# Altium project LCDTestor_EP4CE6E22.PRJPCB
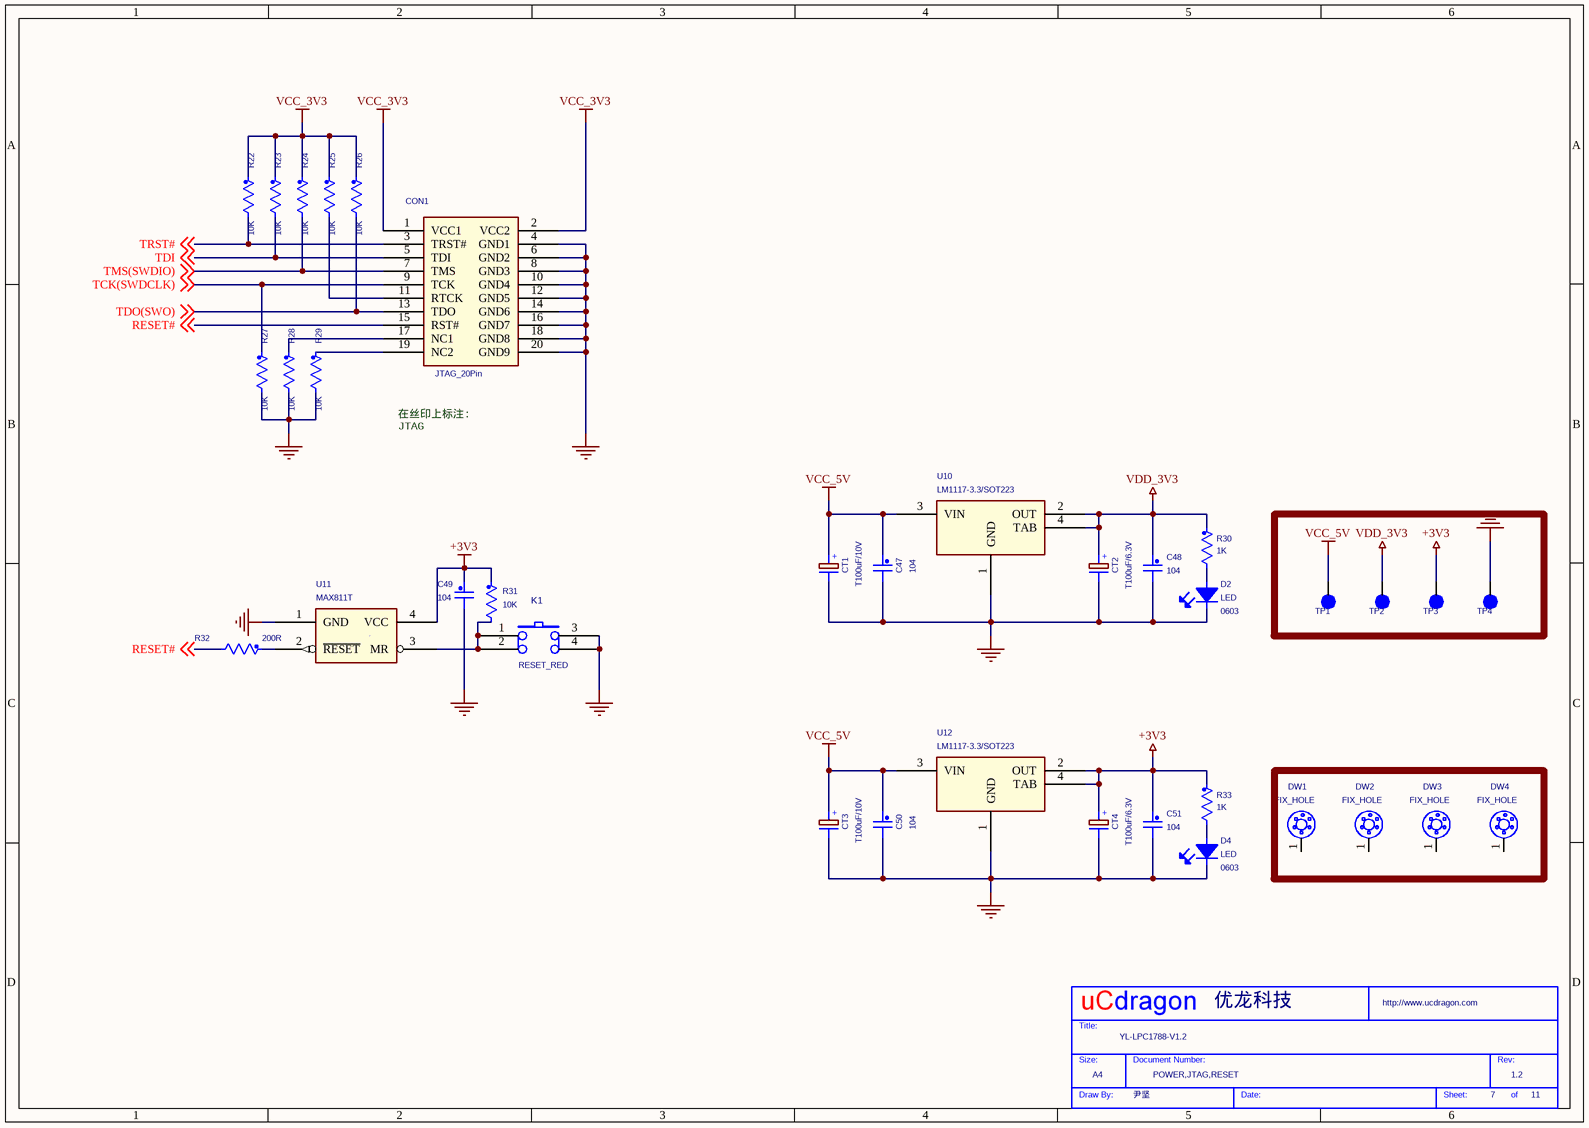
[diagram p0: 07)Power,JTAG,RESET.SchDoc]
9 sheets, 228 parts. Net scope: global (net labels, ports and power ports of the same name join across sheets).
Sheets:
  07)Power,JTAG,RESET.SchDoc
  06)LCD.SchDoc
  05)NorFlash,NandFlash.SchDoc
  04)SDRAM.SchDoc
  03)CPU-3.SchDoc
  02)CPU-2.SchDoc
  01)CPU-1.SchDoc
  08)USB HOST,USB Device,.SchDoc
  09)KEY,LED.SchDoc

## Sheet 07)Power,JTAG,RESET.SchDoc
size 297 x 209 mm

### Parts
(Parts that share a designator on the sheet are numbered #1, #2 ... from top to bottom, then left to right.)
*#1  Page Count: 11  Page Number: 7  Page Size: A4  Title: YL-LPC1788-V1.2  RevCode: 1.2  Doc: POWER,JTAG,RESET  Drawing: 尹坚  Company: 优龙科技  (hidden comment: My Title 0)  (graphical)
C47  104  [CAP0805]
C48  104  [CAP0805]
C49  104  [CAP0805]
C50  104  [CAP0805]
C51#1  104  [CAP0805]
CON1  JTAG_20Pin
CT1  T100uF/10V  [TAN-C]
CT2  T100uF/6.3V  [TAN-B]
CT3  T100uF/10V  [TAN-C]
CT4  T100uF/6.3V  [TAN-B]
D2#1  LED  Note: 0603  [LED3]
D4#1  LED  Note: 0603  [LED3]
DW1  FIX_HOLE  [FULCRUM2]
DW2  FIX_HOLE  [FULCRUM2]
DW3  FIX_HOLE  [FULCRUM2]
DW4  FIX_HOLE  [FULCRUM2]
K1#1  RESET_RED  [SWPB2]
R22  10K  [RES0805]
R23#1  10K  [RES0805]
R24#1  10K  [RES0805]
R25#1  10K  [RES0805]
R26#1  10K  [RES0805]
R27#1  10K  [RES0805]
R28#1  10K  [RES0805]
R29#1  10K  [RES0805]
R30#1  1K  [RES0805]
R31#1  10K  [RES0805]
R32#1  200R  [RES0805]
R33#1  1K  [RES0805]
TP1  TP-SMD  (value not drawn)
TP2  TP-SMD  (value not drawn)
TP3  TP-SMD  (value not drawn)
TP4  TP-SMD  (value not drawn)
U10  LM1117-3.3/SOT223  [XP-SOT223-3]
U11  MAX811T  [SOT143A]
U12  LM1117-3.3/SOT223  [XP-SOT223-3]

### Nets
+3V3: C49.1 C51#1.1 CT4.1 R31#1.1 R33#1.1 TP3.1 U11.4(VCC) U12.2(OUT) U12.4(TAB)
GND_POWER: C47.2 C48.2 C49.2 C50.2 C51#1.2 CON1.4(GND1) CON1.6(GND2) CON1.8(GND3) CON1.10(GND4) CON1.12(GND5) CON1.14(GND6) CON1.16(GND7) CON1.18(GND8) CON1.20(GND9) CT1.2 CT2.2 CT3.2 CT4.2 D2#1.2(K) D4#1.2(K) K1#1.3 K1#1.4 R27#1.2 R28#1.2 R29#1.2 TP4.1 U10.1(GND) U11.1(GND) U12.1(GND)
VCC_3V3: CON1.1(VCC1) CON1.2(VCC2) R22.1 R23#1.1 R24#1.1 R25#1.1 R26#1.1
VCC_5V: C47.1 C50.1 CT1.1 CT3.1 TP1.1 U10.3(VIN) U12.3(VIN)
VDD_3V3: C48.1 CT2.1 R30#1.1 TP2.1 U10.2(OUT) U10.4(TAB)
RESET#: CON1.15(RST#) R32#1.2 ; off-sheet RESET#
TCK(SWDCLK): CON1.9(TCK) R27#1.1 ; off-sheet TCK(SWDCLK)
TDI: CON1.5(TDI) R23#1.2 ; off-sheet TDI
TDO(SWO): CON1.13(TDO) R26#1.2 ; off-sheet TDO(SWO)
TMS(SWDIO): CON1.7(TMS) R24#1.2 ; off-sheet TMS(SWDIO)
TRST#: CON1.3(TRST#) R22.2 ; off-sheet TRST#
NetCON1_11: CON1.11(RTCK) R25#1.2
NetCON1_17: CON1.17(NC1) R28#1.1
NetCON1_19: CON1.19(NC2) R29#1.1
NetD2#1_1: D2#1.1(A) R30#1.2
NetD4#1_1: D4#1.1(A) R33#1.2
NetK1#1_1: K1#1.1 K1#1.2 R31#1.2 U11.3(MR)
NetR32#1_1: R32#1.1 U11.2(~{RESET})

Not connected (* = marked no-connect by the designer): DW1 1; DW2 1; DW3 1; DW4 1

### Notes on the sheet
- 在丝印上标注:
  JTAG
- (in symbol My Title 0) Title:; Size:; Document Number:; Rev:; Draw By:; Date:; Sheet:; of

### Library data of the parts
C47-C50 C51#1 = C_Generic_Dup1: Dielectric: X7R; Mfg #1: KEMET; Voltage: 16V; P/N #1: C0603C104K4RAC; Toler.: 10%
CT1-CT4 = CAP PN_Dup1: SDTSourceLibName: C:\WINDOWS\TEMP\SNDS.LIB
D2#1 D4#1 = LED-Small
K1#1 = SW_PUSH2: SDTSourceLibName: C:\WIND95\TEMP\6200.LIB
R22 R23#1 R24#1 R25#1 R26#1 R27#1 R28#1 R29#1 R31#1 R32#1 = R_Generic_Dup1: Toler.: 1%; Watts: 0.1W; P/N #1: CR10-1001F-T; Mfg #1: AVX
R30#1 R33#1 = R_Generic_Dup1: P/N #3: CR10-103J-T; Toler.: 1%; Watts: 0.1W; P/N #1: RK73H1JT1002F; Mfg #1: KOA SPEER; Mfg #3: AVX
TP1-TP4 = TP-SMD_1
U10 U12 = LM1117 SOT223
U11 = UD215_1
*#1 = My Title 0: Page Create Date: May 29, 2006; WebSite: http://www.ucdragon.com

## Sheet 06)LCD.SchDoc
size 292 x 193 mm
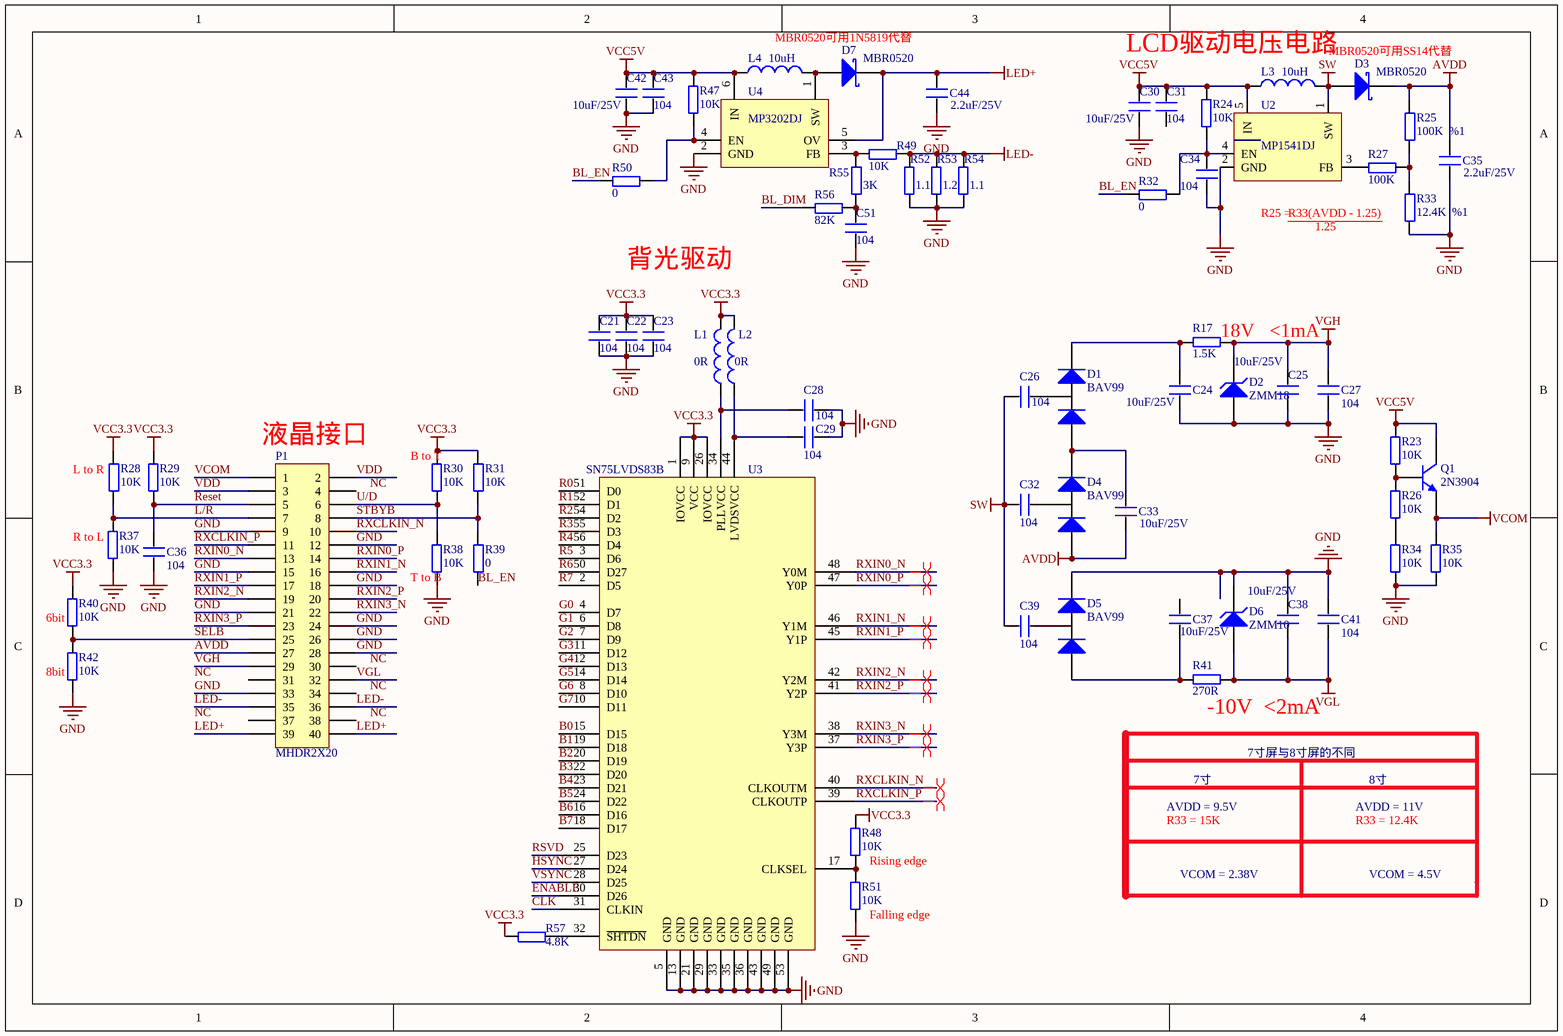
[diagram p1: 06)LCD.SchDoc]

### Parts
(Parts that share a designator on the sheet are numbered #1, #2 ... from top to bottom, then left to right.)
C21#1  104  [0603P]
C22#1  104  [0603P]
C23#1  104  [0603P]
C24#1  10uF/25V  [1206]
C25#1  10uF/25V  [1206]
C26#1  104  [0603P]
C27#1  104  [0603P]
C28#1  104  [0603P]
C29  104  [0603P]
C30  10uF/25V  [1206]
C31  104  [0603P]
C32  104  [0603P]
C33  10uF/25V  [1206]
C34  104  [0603P]
C35  2.2uF/25V  [1206]
C36  104  [0603P]
C37  10uF/25V  [1206]
C38  10uF/25V  [1206]
C39  104  [0603P]
C41  104  [0603P]
C42  10uF/25V  [1206]
C43  104  [0603P]
C44  2.2uF/25V  [1206]
C51#2  104  [0603P]
D1  BAV99  [SOT-23-3L]
D2#2  ZMM18  [LL-34]
D3  MBR0520  [DSO-C2/X2.3]
D4#2  BAV99  [SOT-23-3L]
D5  BAV99  [SOT-23-3L]
D6  ZMM10  [LL-34]
D7  MBR0520  [DSO-C2/X2.3]
L1  value 0R  [0603P]  (hidden comment: Inductor)
L2  value 0R  [0603P]  (hidden comment: Inductor)
L3  value 10uH  [1206]  (hidden comment: Inductor)
L4  value 10uH  [1206]  (hidden comment: Inductor)
P1#1  MHDR2X20  [FH12A-40S-0.5SH]
Q1  2N3904  [SOT-23-3L]
R17  1.5K  [0603P]
R23#2  10K  [0603P]
R24#2  10K  [0603P]
R25#2  100K  %1  [0603P]
R26#2  10K  [0603P]
R27#2  100K  [0603P]
R28#2  10K  [0603P]
R29#2  10K  [0603P]
R30#2  10K  [0603P]
R31#2  10K  [0603P]
R32#2  0  [0603P]
R33#2  12.4K  %1  [0603P]
R34  10K  [0603P]
R35  10K  [0603P]
R37  10K  [0603P]
R38  10K  [0603P]
R39  0  [0603P]
R40  10K  [0603P]
R41  270R  [0603P]
R42  10K  [0603P]
R47  10K  [0603P]
R48  10K  [0603P]
R49  10K  [0603P]
R50  0  [0603P]
R51  10K  [0603P]
R52  1.1  [0603P]
R53  1.2  [0603P]
R54  1.1  [0603P]
R55  3K  [0603P]
R56  82K  [0603P]
R57  4.8K  [0603P]
U2#1  MP1541DJ  [SOT-23-5L]
U3#1  SN75LVDS83B  [DGG056]
U4#1  MP3202DJ  [SOT-23-6L]

### Nets
AVDD: C33.2 C35.1 D3.2(K) D4#2.1(A) P1#1.27 R25#2.2
GND: C21#1.1 C22#1.1 C23#1.1 C24#1.2 C25#1.2 C27#1.2 C28#1.1 C29.1 C30.2 C34.1 C35.2 C36.1 C38.1 C41.1 C42.2 C43.1 C44.2 C51#2.1 D2#2.1(A) D5.2(K) D6.2(K) P1#1.9 P1#1.12 P1#1.15 P1#1.18 P1#1.21 P1#1.24 P1#1.26 P1#1.28 P1#1.33 R33#2.1 R34.2 R35.2 R37.2 R38.2 R42.2 R51.2 R52.2 R53.2 R54.2 U2#1.2(GND) U3#1.5(GND) U3#1.13(GND) U3#1.21(GND) U3#1.29(GND) U3#1.33(GND) U3#1.35(GND) U3#1.36(GND) U3#1.43(GND) U3#1.49(GND) U3#1.53(GND) U4#1.2(GND)
LED+: C44.1 D7.2(K) P1#1.39 P1#1.40 U4#1.5(OV)
LED-: P1#1.35 P1#1.36 R49.2 R52.1 R53.1 R54.1
SW: C26#1.2 C32.1 C39.1 D3.1(A) L3.2 U2#1.1(SW)
VCC3.3: C21#1.2 C22#1.2 C23#1.2 L1.2 L2.2 R28#2.2 R29#2.1 R30#2.1 R31#2.2 R40.1 R48.1 R57.1 U3#1.1(IOVCC) U3#1.9(VCC) U3#1.26(IOVCC)
VCC5V: C30.1 C31.2 C42.1 C43.2 L3.1 L4.1 Q1.3(C) R23#2.1 R24#2.1 R47.1 U2#1.5(IN) U4#1.6(IN)
VCOM: P1#1.1 Q1.2(E) R35.1
VGH: C25#1.1 C27#1.1 D2#2.2(K) P1#1.29 R17.1
VGL: C38.2 C41.2 D6.1(A) P1#1.32 R41.1
B0: U3#1.15(D15)
B1: U3#1.19(D18)
B2: U3#1.20(D19)
B3: U3#1.22(D20)
B4: U3#1.23(D21)
B5: U3#1.24(D22)
B6: U3#1.16(D16)
B7: U3#1.18(D17)
BL_DIM: R56.1
BL_EN: R32#2.1 R39.1 R50.1
CLK: U3#1.31(CLKIN)
ENABLE: U3#1.30(D26)
G0: U3#1.4(D7)
G1: U3#1.6(D8)
G2: U3#1.7(D9)
G3: U3#1.11(D12)
G4: U3#1.12(D13)
G5: U3#1.14(D14)
G6: U3#1.8(D10)
G7: U3#1.10(D11)
HSYNC: U3#1.27(D24)
L/R: P1#1.7 R28#2.1 R37.1
R0: U3#1.51(D0)
R1: U3#1.52(D1)
R2: U3#1.54(D2)
R3: U3#1.55(D3)
R4: U3#1.56(D4)
R5: U3#1.3(D6)
R6: U3#1.50(D27)
R7: U3#1.2(D5)
Reset: C36.2 P1#1.5 R29#2.2
RSVD: U3#1.25(D23)
RXCLKIN_N: P1#1.10 U3#1.40(CLKOUTM)
RXCLKIN_P: P1#1.11 U3#1.39(CLKOUTP)
RXIN0_N: P1#1.13 U3#1.48(Y0M)
RXIN0_P: P1#1.14 U3#1.47(Y0P)
RXIN1_N: P1#1.16 U3#1.46(Y1M)
RXIN1_P: P1#1.17 U3#1.45(Y1P)
RXIN2_N: P1#1.19 U3#1.42(Y2M)
RXIN2_P: P1#1.20 U3#1.41(Y2P)
RXIN3_N: P1#1.22 U3#1.38(Y3M)
RXIN3_P: P1#1.23 U3#1.37(Y3P)
SELB: P1#1.25 R40.2 R42.1
STBYB: P1#1.8 R31#2.1 R39.2
U/D: P1#1.6 R30#2.2 R38.1
VDD: P1#1.2 P1#1.3
VSYNC: U3#1.28(D25)
NetC24#1_1: C24#1.1 D1.2(K) R17.2
NetC26#1_1: C26#1.1 D1.3(A)
NetC28#1_2: C28#1.2 L1.1 U3#1.34(PLLVCC)
NetC29_2: C29.2 L2.1 U3#1.44(LVDSVCC)
NetC32_2: C32.2 D4#2.3(A)
NetC33_1: C33.1 D1.1(A) D4#2.2(K)
NetC34_2: C34.2 R24#2.2 R32#2.2 U2#1.4(EN)
NetC37_2: C37.2 D5.1(A) R41.2
NetC39_2: C39.2 D5.3(A)
NetC51#2_2: C51#2.2 R55.1 R56.2
NetD7_1: D7.1(A) L4.2 U4#1.1(SW)
NetQ1_1: Q1.1(B) R23#2.2 R26#2.1
NetR25#2_1: R25#2.1 R27#2.2 R33#2.2
NetR26#2_2: R26#2.2 R34.1
NetR27#2_1: R27#2.1 U2#1.3(FB)
NetR47_2: R47.2 R50.2 U4#1.4(EN)
NetR48_2: R48.2 R51.1 U3#1.17(CLKSEL)
NetR49_1: R49.1 R55.2 U4#1.3(FB)
NetR57_2: R57.2 U3#1.32(~{SHTDN})

Not connected (* = marked no-connect by the designer): C31 1; C37 1; P1#1 4 30 31 34 37 38

### Layout directives
differential pair: RXCLKIN_N, RXCLKIN_P, RXIN0_N, RXIN0_P, RXIN1_N, RXIN1_P, RXIN2_N, RXIN2_P, RXIN3_N, RXIN3_P

### Notes on the sheet
- MBR0520可用1N5819代替
- LCD驱动电压电路
- MBR0520可用SS14代替
- R25 =
- R33(AVDD - 1.25)
- 1.25
- 背光驱动
- (near R17) 18V   <1mA
- (near P1#1) 液晶接口
- (near R28#2) L to R
- (near R30#2) B to T
- (near R37) R to L
- (near R38) T to B
- (near R40) 6bit
- (near R42) 8bit
- (near R41) -10V  <2mA
- 7寸
- 7寸屏与8寸屏的不同
- 8寸
- AVDD = 9.5V
- R33 = 15K
- AVDD = 11V
- R33 = 12.4K
- Rising edge
- (near R51) Falling edge
- VCOM = 2.38V
- VCOM = 4.5V
- Labels drawn without touching a wire or pin: NC

### Library data of the parts
C21#1 C22#1 C23#1 C24#1 C25#1 C26#1 C27#1 C28#1 C29-C39 C41-C44 C51#2 = C
D2#2 D6 = D Zener: Zener Diode; Published: 8-Jun-2000; LatestRevisionDate: 17-Jul-2002; LatestRevisionNote: Re-released for DXP Platform.; PackageReference: DIODE-0.7; Publisher: Altium Limited
D3 D7 = D Schottky: Schottky Diode; Published: 8-Jun-2000; LatestRevisionDate: 17-Jul-2002; LatestRevisionNote: Re-released for DXP Platform.; PackageReference: SMB; Publisher: Altium Limited; Code_JEDEC: DO-214-AA
L1-L4 = Inductor: Code_IEC: 1005; Published: 8-Jun-2000; LatestRevisionDate: 29-May-2009; LatestRevisionNote: IPC-7351 Footprint Added.; PackageReference: 0402-A; Publisher: Altium Limited; PackageDescription: Chip Inductor; Code_JEITA: 0402
P1#1 = MHDR2X20: Header, 20-Pin, Dual row; LatestRevisionDate: 17-Jul-2002; LatestRevisionNote: Re-released for DXP Platform.; Publisher: Altium Limited
Q1 = 2N3904: NPN General Purpose Amplifier; Published: 8-Jun-2000; LatestRevisionDate: 15-Jan-2003; LatestRevisionNote: PCB Footprint 'BCY-W3/D4.7' replaced; DatasheetVersion: 1997; PackageVersion: Sep-1998; PackageReference: TO-92A; Publisher: Altium Limited; Code_JEDEC: TO-92A; ComponentLink1Description: Manufacturer Link; ComponentLink1URL: http://www.fairchildsemi.com/; ComponentLink2Description: Datasheet; ComponentLink2URL: http://www.fairchildsemi.com/ds/2N%2F2N3904.pdf
R17 R23#2 R24#2 R25#2 R26#2 R27#2 R28#2 R29#2 R30#2 R31#2 R32#2 R33#2 R34 R35 R37-R42 R47-R57 = R
U2#1 = MP1541
U4#1 = MP3202

## Sheet 05)NorFlash,NandFlash.SchDoc
size 297 x 209 mm
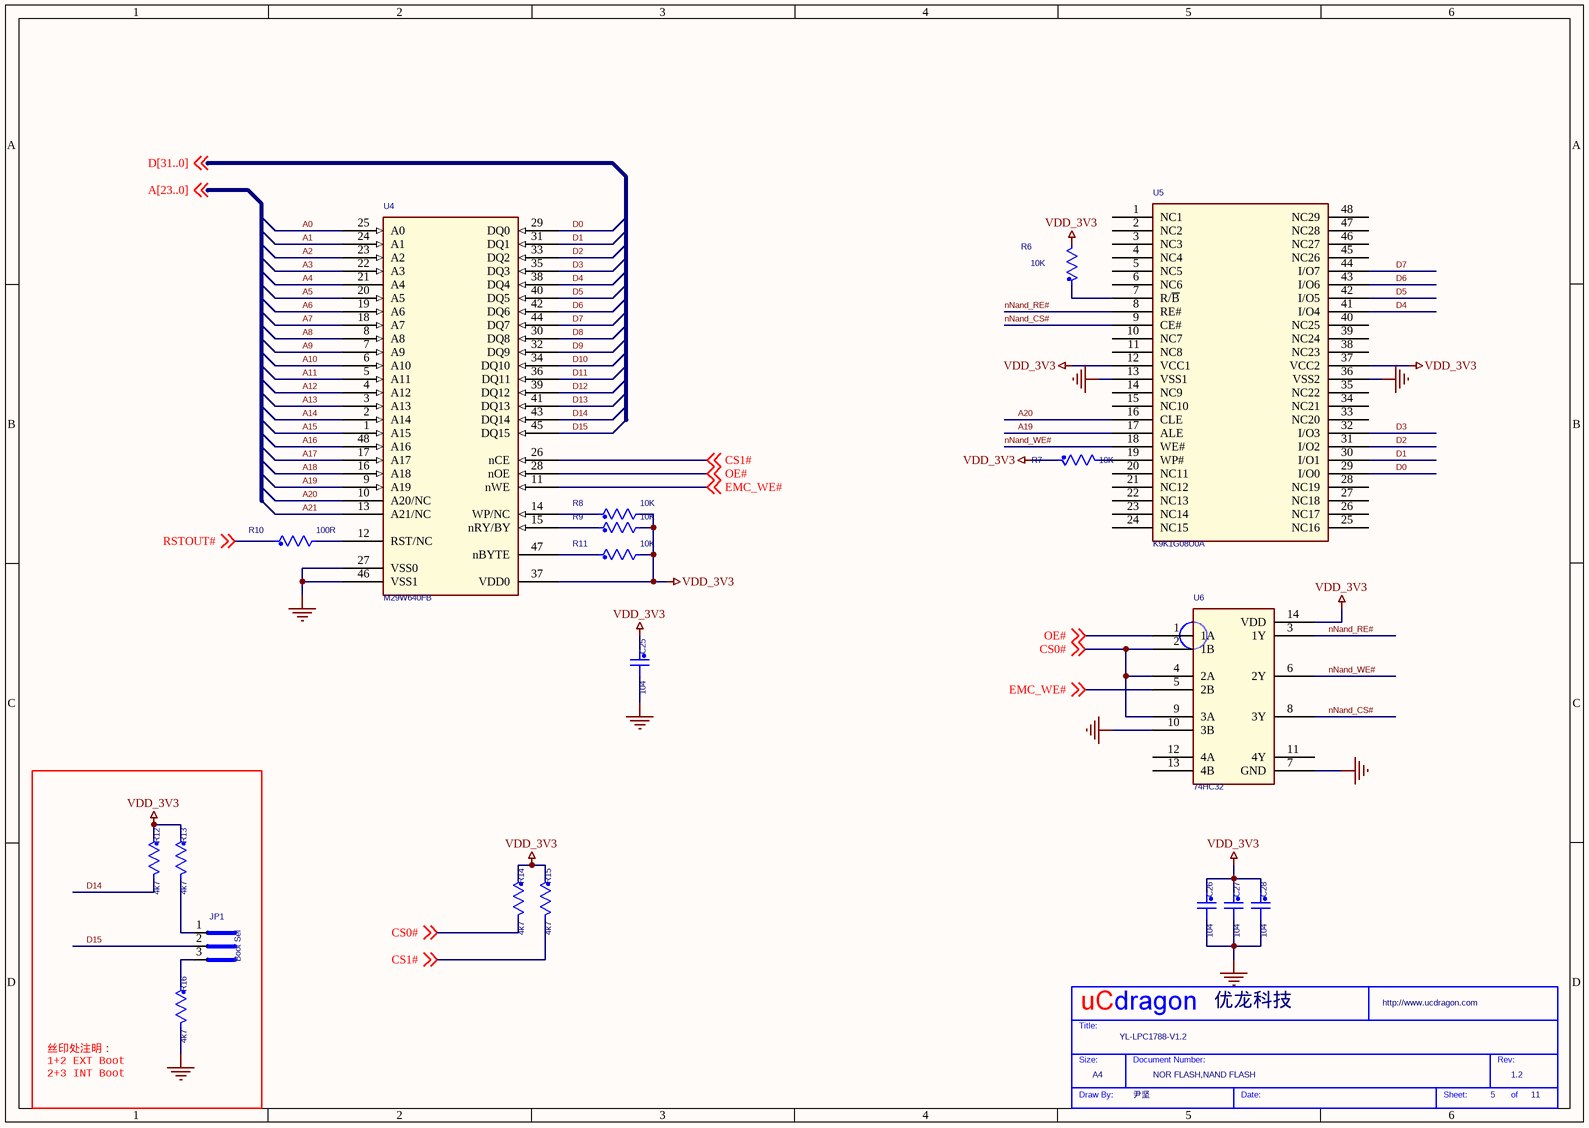
[diagram p2: 05)NorFlash,NandFlash.SchDoc]

### Parts
(Parts that share a designator on the sheet are numbered #1, #2 ... from top to bottom, then left to right.)
*#2  Page Count: 11  Page Number: 5  Page Size: A4  Title: YL-LPC1788-V1.2  RevCode: 1.2  Doc: NOR FLASH,NAND FLASH  Drawing: 尹坚  Company: 优龙科技  (hidden comment: My Title 0)  (graphical)
C25#2  104  [CAP0805]
C26#2  104  [CAP0805]
C27#2  104  [CAP0805]
C28#2  104  [CAP0805]
JP1  Boot Sel
R6  10K
R7#1  10K
R8  10K
R9  10K
R10  100R
R11#1  10K
R12#1  4k7
R13#1  4k7
R14#1  4k7
R15  4k7
R16  4k7
U4#2  M29W640FB  [SST39VF1601-TSOP48A]
U5  K9K1G08U0A  [TSOP1]
U6  74HC32

### Nets
GND_POWER: C25#2.2 C26#2.2 C27#2.2 C28#2.2 R16.2 U4#2.27(VSS0) U4#2.46(VSS1) U5.13(VSS1) U5.36(VSS2) U6.7(GND) U6.10(3B)
VDD_3V3: C25#2.1 C26#2.1 C27#2.1 C28#2.1 R6.2 R7#1.1 R8.2 R9.2 R11#1.2 R12#1.1 R13#1.1 R14#1.1 R15.1 U4#2.37(VDD0) U5.12(VCC1) U5.37(VCC2) U6.14(VDD)
A0: U4#2.25(A0)
A1: U4#2.24(A1)
A2: U4#2.23(A2)
A3: U4#2.22(A3)
A4: U4#2.21(A4)
A5: U4#2.20(A5)
A6: U4#2.19(A6)
A7: U4#2.18(A7)
A8: U4#2.8(A8)
A9: U4#2.7(A9)
A10: U4#2.6(A10)
A11: U4#2.5(A11)
A12: U4#2.4(A12)
A13: U4#2.3(A13)
A14: U4#2.2(A14)
A15: U4#2.1(A15)
A16: U4#2.48(A16)
A17: U4#2.17(A17)
A18: U4#2.16(A18)
A19: U4#2.9(A19) U5.17(ALE)
A20: U4#2.10(A20/NC) U5.16(CLE)
A21: U4#2.13(A21/NC)
CS0#: R14#1.2 U6.2(1B) U6.4(2A) U6.9(3A) ; off-sheet CS0#
CS1#: R15.2 U4#2.26(nCE) ; off-sheet CS1#
D0: U4#2.29(DQ0) U5.29(I/O0)
D1: U4#2.31(DQ1) U5.30(I/O1)
D2: U4#2.33(DQ2) U5.31(I/O2)
D3: U4#2.35(DQ3) U5.32(I/O3)
D4: U4#2.38(DQ4) U5.41(I/O4)
D5: U4#2.40(DQ5) U5.42(I/O5)
D6: U4#2.42(DQ6) U5.43(I/O6)
D7: U4#2.44(DQ7) U5.44(I/O7)
D8: U4#2.30(DQ8)
D9: U4#2.32(DQ9)
D10: U4#2.34(DQ10)
D11: U4#2.36(DQ11)
D12: U4#2.39(DQ12)
D13: U4#2.41(DQ13)
D14: R12#1.2 U4#2.43(DQ14)
D15: JP1.2 U4#2.45(DQ15)
EMC_WE#: U4#2.11(nWE) U6.5(2B) ; off-sheet EMC_WE#
nNand_CS#: U5.9(CE#) U6.8(3Y)
nNand_RE#: U5.8(RE#) U6.3(1Y)
nNand_WE#: U5.18(WE#) U6.6(2Y)
OE#: U4#2.28(nOE) U6.1(1A) ; off-sheet OE#
RSTOUT#: R10.1 ; off-sheet RSTOUT#
NetJP1_1: JP1.1 R13#1.2
NetJP1_3: JP1.3 R16.1
NetR6_1: R6.1 U5.7(R/~{B})
NetR7#1_2: R7#1.2 U5.19(WP#)
NetR8_1: R8.1 U4#2.14(WP/NC)
NetR9_1: R9.1 U4#2.15(nRY/BY)
NetR10_2: R10.2 U4#2.12(RST/NC)
NetR11#1_1: R11#1.1 U4#2.47(nBYTE)

Not connected (* = marked no-connect by the designer): U5 1(NC1) 2(NC2) 3(NC3) 4(NC4) 5(NC5) 6(NC6) 10(NC7) 11(NC8) 14(NC9) 15(NC10) 20(NC11) 21(NC12) 22(NC13) 23(NC14) 24(NC15) 25(NC16) 26(NC17) 27(NC18) 28(NC19) 33(NC20) 34(NC21) 35(NC22) 38(NC23) 39(NC24) 40(NC25) 45(NC26) 46(NC27) 47(NC28) 48(NC29); U6 11(4Y) 12(4A) 13(4B)

### Notes on the sheet
- (near R16) 丝印处注明：
  1+2 EXT Boot
  2+3 INT Boot
- (in symbol My Title 0) Title:; Size:; Document Number:; Rev:; Draw By:; Date:; Sheet:; of

### Library data of the parts
C25#2 C26#2 C27#2 C28#2 = C_Generic_Dup2
JP1 = 3PIN
R6 R7#1 R8-R10 R11#1 R12#1 R13#1 R14#1 R15 R16 = R_Generic_Dup1
U4#2 = SST29LV800_1: P/N #1: TSOP48
*#2 = My Title 0: Page Create Date: May 29, 2006; WebSite: http://www.ucdragon.com

## Sheet 04)SDRAM.SchDoc
size 297 x 209 mm
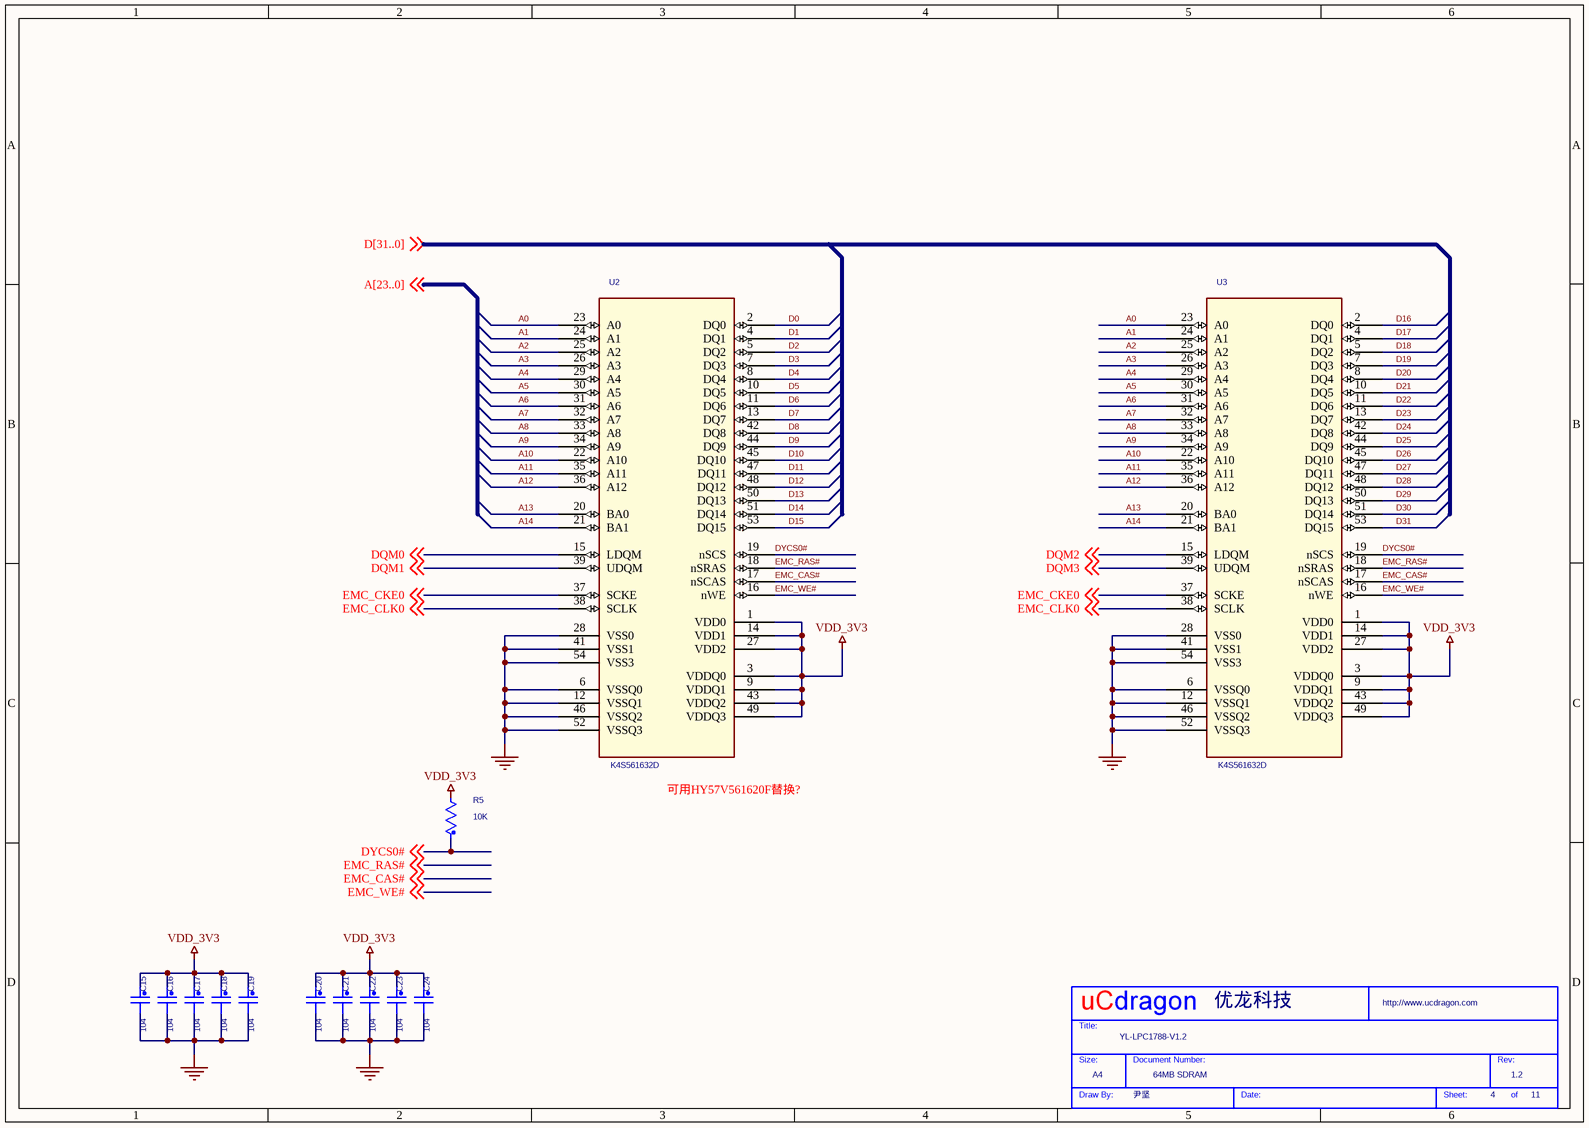
[diagram p3: 04)SDRAM.SchDoc]

### Parts
(Parts that share a designator on the sheet are numbered #1, #2 ... from top to bottom, then left to right.)
*#3  Page Count: 11  Page Number: 4  Page Size: A4  Title: YL-LPC1788-V1.2  RevCode: 1.2  Doc: 64MB SDRAM  Drawing: 尹坚  Company: 优龙科技  (hidden comment: My Title 0)  (graphical)
C15  104  [CAP0805]
C16  104  [CAP0805]
C17  104  [CAP0805]
C18#1  104  [CAP0805]
C19  104  [CAP0805]
C20  104  [CAP0805]
C21#2  104  [CAP0805]
C22#2  104  [CAP0805]
C23#2  104  [CAP0805]
C24#2  104  [CAP0805]
R5#1  10K
U2#2  K4S561632D
U3#2  K4S561632D

### Nets
GND_POWER: C15.2 C16.2 C17.2 C18#1.2 C19.2 C20.2 C21#2.2 C22#2.2 C23#2.2 C24#2.2 U2#2.6(VSSQ0) U2#2.12(VSSQ1) U2#2.28(VSS0) U2#2.41(VSS1) U2#2.46(VSSQ2) U2#2.52(VSSQ3) U2#2.54(VSS3) U3#2.6(VSSQ0) U3#2.12(VSSQ1) U3#2.28(VSS0) U3#2.41(VSS1) U3#2.46(VSSQ2) U3#2.52(VSSQ3) U3#2.54(VSS3)
VDD_3V3: C15.1 C16.1 C17.1 C18#1.1 C19.1 C20.1 C21#2.1 C22#2.1 C23#2.1 C24#2.1 R5#1.2 U2#2.1(VDD0) U2#2.3(VDDQ0) U2#2.9(VDDQ1) U2#2.14(VDD1) U2#2.27(VDD2) U2#2.43(VDDQ2) U2#2.49(VDDQ3) U3#2.1(VDD0) U3#2.3(VDDQ0) U3#2.9(VDDQ1) U3#2.14(VDD1) U3#2.27(VDD2) U3#2.43(VDDQ2) U3#2.49(VDDQ3)
A0: U2#2.23(A0) U3#2.23(A0)
A1: U2#2.24(A1) U3#2.24(A1)
A2: U2#2.25(A2) U3#2.25(A2)
A3: U2#2.26(A3) U3#2.26(A3)
A4: U2#2.29(A4) U3#2.29(A4)
A5: U2#2.30(A5) U3#2.30(A5)
A6: U2#2.31(A6) U3#2.31(A6)
A7: U2#2.32(A7) U3#2.32(A7)
A8: U2#2.33(A8) U3#2.33(A8)
A9: U2#2.34(A9) U3#2.34(A9)
A10: U2#2.22(A10) U3#2.22(A10)
A11: U2#2.35(A11) U3#2.35(A11)
A12: U2#2.36(A12) U3#2.36(A12)
A13: U2#2.20(BA0) U3#2.20(BA0)
A14: U2#2.21(BA1) U3#2.21(BA1)
D0: U2#2.2(DQ0)
D1: U2#2.4(DQ1)
D2: U2#2.5(DQ2)
D3: U2#2.7(DQ3)
D4: U2#2.8(DQ4)
D5: U2#2.10(DQ5)
D6: U2#2.11(DQ6)
D7: U2#2.13(DQ7)
D8: U2#2.42(DQ8)
D9: U2#2.44(DQ9)
D10: U2#2.45(DQ10)
D11: U2#2.47(DQ11)
D12: U2#2.48(DQ12)
D13: U2#2.50(DQ13)
D14: U2#2.51(DQ14)
D15: U2#2.53(DQ15)
D16: U3#2.2(DQ0)
D17: U3#2.4(DQ1)
D18: U3#2.5(DQ2)
D19: U3#2.7(DQ3)
D20: U3#2.8(DQ4)
D21: U3#2.10(DQ5)
D22: U3#2.11(DQ6)
D23: U3#2.13(DQ7)
D24: U3#2.42(DQ8)
D25: U3#2.44(DQ9)
D26: U3#2.45(DQ10)
D27: U3#2.47(DQ11)
D28: U3#2.48(DQ12)
D29: U3#2.50(DQ13)
D30: U3#2.51(DQ14)
D31: U3#2.53(DQ15)
DQM0: U2#2.15(LDQM) ; off-sheet DQM0
DQM1: U2#2.39(UDQM) ; off-sheet DQM1
DQM2: U3#2.15(LDQM) ; off-sheet DQM2
DQM3: U3#2.39(UDQM) ; off-sheet DQM3
DYCS0#: R5#1.1 U2#2.19(nSCS) U3#2.19(nSCS) ; off-sheet DYCS0#
EMC_CAS#: U2#2.17(nSCAS) U3#2.17(nSCAS) ; off-sheet EMC_CAS#
EMC_CKE0: U2#2.37(SCKE) U3#2.37(SCKE) ; off-sheet EMC_CKE0
EMC_CLK0: U2#2.38(SCLK) U3#2.38(SCLK) ; off-sheet EMC_CLK0
EMC_RAS#: U2#2.18(nSRAS) U3#2.18(nSRAS) ; off-sheet EMC_RAS#
EMC_WE#: U2#2.16(nWE) U3#2.16(nWE) ; off-sheet EMC_WE#

### Notes on the sheet
- 可用HY57V561620F替换?
- (in symbol My Title 0) Title:; Size:; Document Number:; Rev:; Draw By:; Date:; Sheet:; of

### Library data of the parts
C15-C17 C18#1 C19 C20 C21#2 C22#2 C23#2 C24#2 = C_Generic_Dup2
R5#1 = R_Generic_Dup1
*#3 = My Title 0: Page Create Date: May 29, 2006; WebSite: http://www.ucdragon.com

## Sheet 03)CPU-3.SchDoc
size 297 x 209 mm
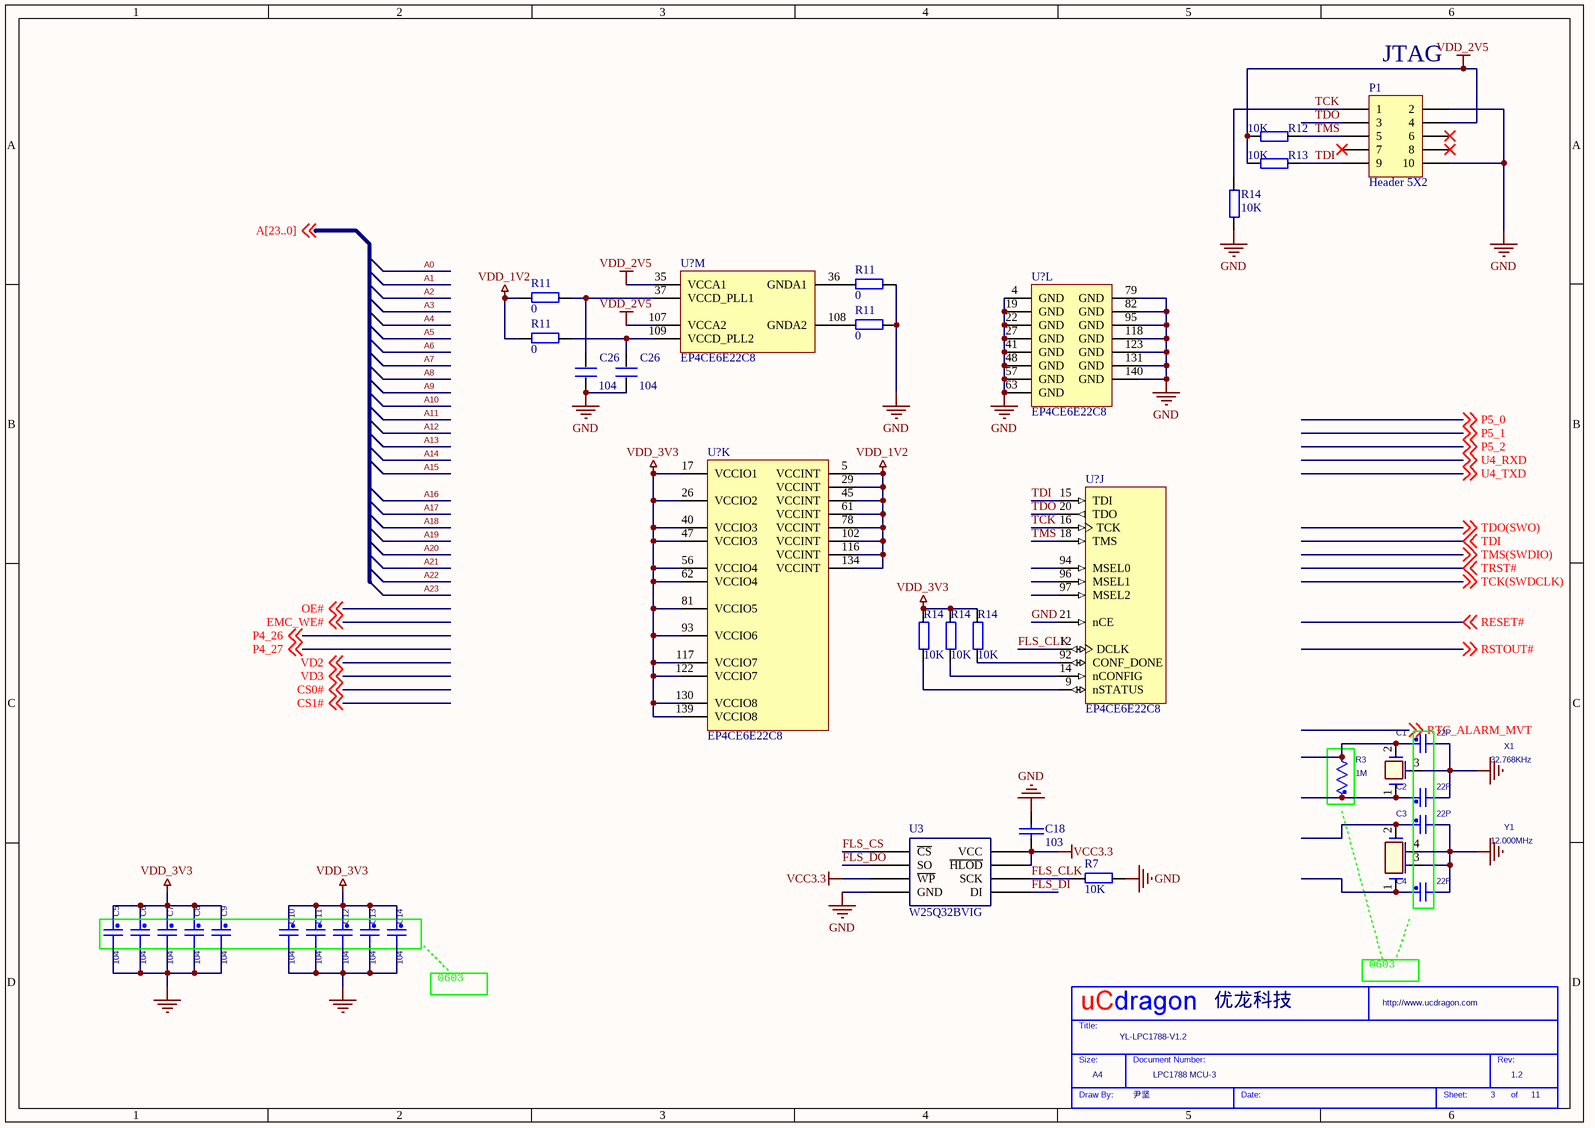
[diagram p4: 03)CPU-3.SchDoc]

### Parts
(Parts that share a designator on the sheet are numbered #1, #2 ... from top to bottom, then left to right.)
*#4  Page Count: 11  Page Number: 3  Page Size: A4  Title: YL-LPC1788-V1.2  RevCode: 1.2  Doc: LPC1788 MCU-3  Drawing: 尹坚  Company: 优龙科技  (hidden comment: My Title 0)  (graphical)
C1  22P  [CAP0805]
C2  22P  [CAP0805]
C3  22P  [CAP0805]
C4  22P  [CAP0805]
C5  104  [CAP0805]
C6  104  [CAP0805]
C7  104  [CAP0805]
C8  104  [CAP0805]
C9#1  104  [CAP0805]
C10#1  104  [CAP0805]
C11  104  [CAP0805]
C12  104  [CAP0805]
C13  104  [CAP0805]
C14  104  [CAP0805]
C18#2  103  [0603]
C26#3  104  [0603]
C26#4  104  [0603]
P1#2  Header 5X2  [HDR2X5]
R3  1M
R7#2  10K  [0603]
R11#2  0  [0603]
R11#3  0  [0603]
R11#4  0  [0603]
R11#5  0  [0603]
R12#2  10K  [0603]
R13#2  10K  [0603]
R14#2  10K  [0603]
R14#3  10K  [0603]
R14#4  10K  [0603]
R14#5  10K  [0603]
U3#3  W25Q32BVIG  [8S2]
U?#1  EP4CE6E22C8  [EQFP144_N]  (part M of 13)
U?#2  EP4CE6E22C8  [EQFP144_N]  (part L of 13)
U?#3  EP4CE6E22C8  [EQFP144_N]  (part K of 13)
U?#4  EP4CE6E22C8  [EQFP144_N]  (part J of 13)
X1  32.768KHz
Y1  12.000MHz

### Nets
GND: C18#2.2 C26#3.2 C26#4.2 P1#2.2 P1#2.10 R7#2.1 R11#2.1 R11#4.1 R14#2.1 U3#3.4(GND) U?#2.4(GND) U?#2.19(GND) U?#2.22(GND) U?#2.27(GND) U?#2.41(GND) U?#2.48(GND) U?#2.57(GND) U?#2.63(GND) U?#2.79(GND) U?#2.82(GND) U?#2.95(GND) U?#2.118(GND) U?#2.123(GND) U?#2.131(GND) U?#2.140(GND) U?#4.21(nCE)
GND_POWER: C1.2 C2.2 C3.2 C4.2 C5.2 C6.2 C7.2 C8.2 C9#1.2 C10#1.2 C11.2 C12.2 C13.2 C14.2 X1.3(GND) Y1.3(GND) Y1.4(GND)
VCC3.3: C18#2.1 U3#3.3(~{WP}) U3#3.7(~{HLOD}) U3#3.8(VCC)
VDD_1V2: R11#3.2 R11#5.2 U?#3.5(VCCINT) U?#3.29(VCCINT) U?#3.45(VCCINT) U?#3.61(VCCINT) U?#3.78(VCCINT) U?#3.102(VCCINT) U?#3.116(VCCINT) U?#3.134(VCCINT)
VDD_2V5: P1#2.4 R12#2.1 R13#2.1 U?#1.35(VCCA1) U?#1.107(VCCA2)
VDD_3V3: C5.1 C6.1 C7.1 C8.1 C9#1.1 C10#1.1 C11.1 C12.1 C13.1 C14.1 R14#3.2 R14#4.2 R14#5.2 U?#3.17(VCCIO1) U?#3.26(VCCIO2) U?#3.40(VCCIO3) U?#3.47(VCCIO3) U?#3.56(VCCIO4) U?#3.62(VCCIO4) U?#3.81(VCCIO5) U?#3.93(VCCIO6) U?#3.117(VCCIO7) U?#3.122(VCCIO7) U?#3.130(VCCIO8) U?#3.139(VCCIO8)
FLS_CLK: R7#2.2 U3#3.6(SCK) U?#4.12(DCLK)
FLS_CS: U3#3.1(~{CS})
FLS_DI: U3#3.5(DI)
FLS_DO: U3#3.2(SO)
TCK: P1#2.1 R14#2.2 U?#4.16(TCK)
TDI: P1#2.9 R13#2.2 U?#4.15(TDI) ; off-sheet TDI
TDO: P1#2.3 U?#4.20(TDO)
TMS: P1#2.5 R12#2.2 U?#4.18(TMS)
NetC1_1: C1.1 R3.2 X1.2
NetC2_1: C2.1 R3.1 X1.1
NetC3_1: C3.1 Y1.2
NetC4_1: C4.1 Y1.1
NetC26#3_1: C26#3.1 R11#3.1 U?#1.37(VCCD_PLL1)
NetC26#4_1: C26#4.1 R11#5.1 U?#1.109(VCCD_PLL2)
NetR11#2_2: R11#2.2 U?#1.36(GNDA1)
NetR11#4_2: R11#4.2 U?#1.108(GNDA2)
NetR14#3_1: R14#3.1 U?#4.9(nSTATUS)
NetR14#4_1: R14#4.1 U?#4.14(nCONFIG)
NetR14#5_1: R14#5.1 U?#4.92(CONF_DONE)

Not connected (* = marked no-connect by the designer): P1#2 6* 7* 8*; U?#4 94(MSEL0) 96(MSEL1) 97(MSEL2)

### Notes on the sheet
- (near P1#2) JTAG
- 0603
- (in symbol My Title 0) Title:; Size:; Document Number:; Rev:; Draw By:; Date:; Sheet:; of

### Library data of the parts
C1-C8 C9#1 C10#1 C11-C14 = C_Generic_Dup2
C18#2 = CAP: Capacitor
C26#3 C26#4 = C
P1#2 = Header 5X2: Header, 5-Pin, Dual row; LatestRevisionDate: 17-Jul-2002; LatestRevisionNote: Re-released for DXP Platform.; Publisher: Altium Limited
R3 = R_Generic_Dup2
R7#2 R11#2-R11#5 R12#2 R13#2 R14#2-R14#5 = R
U?#1-U?#4 = EP4CE6E22C8: Cyclone IV Family FPGA, 2V Core, 91 I/O Pins, 2 PLLs, 144-Pin QFP, Speed Grade 8, Commercial Grade; Published: 3-May-2010; DatasheetVersion: ver1.2, Mar-2010; PackageVersion: ver16.0, Dec-2009; PackageReference: EQFP144; Publisher: Altium Limited; PackageDescription: 144-Pin Plastic Enhanced Quad Flat Pack (EQFP144) - Wire Bond; Code_JEDEC: MS-026-BFB; ComponentLink1Description: Manufacturer Link; ComponentLink1URL: http://www.altera.com/; ComponentLink2Description: Handbook; ComponentLink2URL: http://www.altera.com/literature/hb/cyclone-iv/cyclone4-handbook.pdf; ComponentLink3Description: Pinout Specification; ComponentLink3URL: http://www.altera.com/literature/lit-dp.jsp?category=cyc%204&showspreadsheet=y; ComponentLink4Description: Packaging Specification; ComponentLink4URL: http://www.altera.com/literature/ds/dspkg.pdf
X1 = XTAL1
Y1 = XTAL3
*#4 = My Title 0: Page Create Date: May 29, 2006; WebSite: http://www.ucdragon.com

## Sheet 02)CPU-2.SchDoc
size 297 x 209 mm
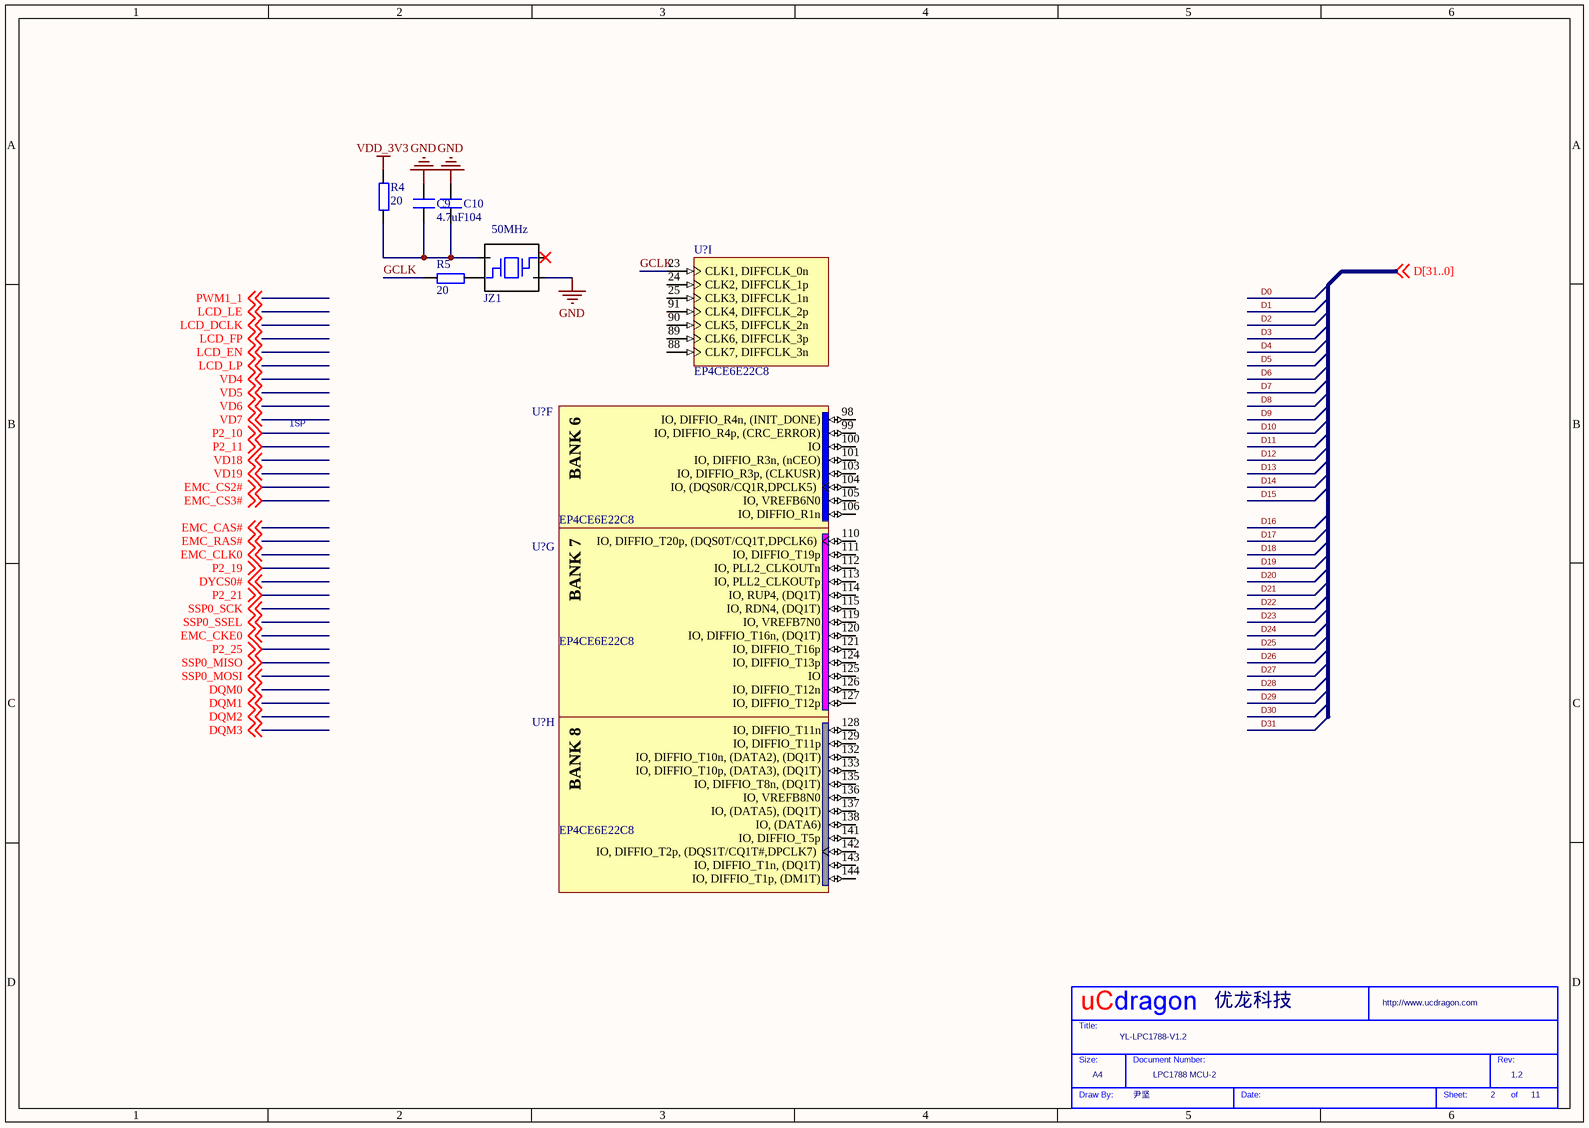
[diagram p5: 02)CPU-2.SchDoc]

### Parts
(Parts that share a designator on the sheet are numbered #1, #2 ... from top to bottom, then left to right.)
*#5  Page Count: 11  Page Number: 2  Page Size: A4  Title: YL-LPC1788-V1.2  RevCode: 1.2  Doc: LPC1788 MCU-2  Drawing: 尹坚  Company: 优龙科技  (hidden comment: My Title 0)  (graphical)
C9#2  4.7uF  [0805]
C10#2  104  [0603]
JZ1  50MHz  [Q5*7]
R4  20  [0603]
R5#2  20  [0603]
U?#5  EP4CE6E22C8  [EQFP144_N]  (part I of 13)
U?#6  EP4CE6E22C8  [EQFP144_N]  (part F of 13)
U?#7  EP4CE6E22C8  [EQFP144_N]  (part G of 13)
U?#8  EP4CE6E22C8  [EQFP144_N]  (part H of 13)

### Nets
GND: C9#2.1 C10#2.1 JZ1.2
VDD_3V3: R4.2
GCLK: R5#2.1 U?#5.23(CLK1,_DIFFCLK_0n)
NetC9#2_2: C9#2.2 C10#2.2 JZ1.4 R4.1
NetJZ1_3: JZ1.3 R5#2.2

Not connected (* = marked no-connect by the designer): JZ1 1*; U?#5 24(CLK2,_DIFFCLK_1p) 25(CLK3,_DIFFCLK_1n) 88(CLK7,_DIFFCLK_3n) 89(CLK6,_DIFFCLK_3p) 90(CLK5,_DIFFCLK_2n) 91(CLK4,_DIFFCLK_2p); U?#6 98(IO,_DIFFIO_R4n,_(INIT_DONE)) 99(IO,_DIFFIO_R4p,_(CRC_ERROR)) 100(IO) 101(IO,_DIFFIO_R3n,_(nCEO)) 103(IO,_DIFFIO_R3p,_(CLKUSR)) 104(IO,_(DQS0R/CQ1R,DPCLK5)) 105(IO,_VREFB6N0) 106(IO,_DIFFIO_R1n); U?#7 110(IO,_DIFFIO_T20p,_(DQS0T/CQ1T,DPCLK6)) 111(IO,_DIFFIO_T19p) 112(IO,_PLL2_CLKOUTn) 113(IO,_PLL2_CLKOUTp) 114(IO,_RUP4,_(DQ1T)) 115(IO,_RDN4,_(DQ1T)) 119(IO,_VREFB7N0) 120(IO,_DIFFIO_T16n,_(DQ1T)) 121(IO,_DIFFIO_T16p) 124(IO,_DIFFIO_T13p) 125(IO) 126(IO,_DIFFIO_T12n) 127(IO,_DIFFIO_T12p); U?#8 128(IO,_DIFFIO_T11n) 129(IO,_DIFFIO_T11p) 132(IO,_DIFFIO_T10n,_(DATA2),_(DQ1T)) 133(IO,_DIFFIO_T10p,_(DATA3),_(DQ1T)) 135(IO,_DIFFIO_T8n,_(DQ1T)) 136(IO,_VREFB8N0) 137(IO,_(DATA5),_(DQ1T)) 138(IO,_(DATA6)) 141(IO,_DIFFIO_T5p) 142(IO,_DIFFIO_T2p,_(DQS1T/CQ1T#,DPCLK7)) 143(IO,_DIFFIO_T1n,_(DQ1T)) 144(IO,_DIFFIO_T1p,_(DM1T))

### Notes on the sheet
- ISP
- (in symbol My Title 0) Title:; Size:; Document Number:; Rev:; Draw By:; Date:; Sheet:; of

### Library data of the parts
C9#2 C10#2 = C
JZ1 = JZ-4P: 4脚晶振; pin to pad: 0>1
R4 R5#2 = R
U?#5-U?#8 = EP4CE6E22C8: as U?#1 on sheet 03)CPU-3; Published: 3-May-2010; DatasheetVersion: ver1.2, Mar-2010; PackageVersion: ver16.0, Dec-2009; PackageReference: EQFP144; Publisher: Altium Limited; PackageDescription: 144-Pin Plastic Enhanced Quad Flat Pack (EQFP144) - Wire Bond; Code_JEDEC: MS-026-BFB; ComponentLink1Description: Manufacturer Link; ComponentLink1URL: http://www.altera.com/; ComponentLink2Description: Handbook; ComponentLink2URL: http://www.altera.com/literature/hb/cyclone-iv/cyclone4-handbook.pdf; ComponentLink3Description: Pinout Specification; ComponentLink3URL: http://www.altera.com/literature/lit-dp.jsp?category=cyc%204&showspreadsheet=y; ComponentLink4Description: Packaging Specification; ComponentLink4URL: http://www.altera.com/literature/ds/dspkg.pdf
*#5 = My Title 0: Page Create Date: May 29, 2006; WebSite: http://www.ucdragon.com

## Sheet 01)CPU-1.SchDoc
size 297 x 209 mm
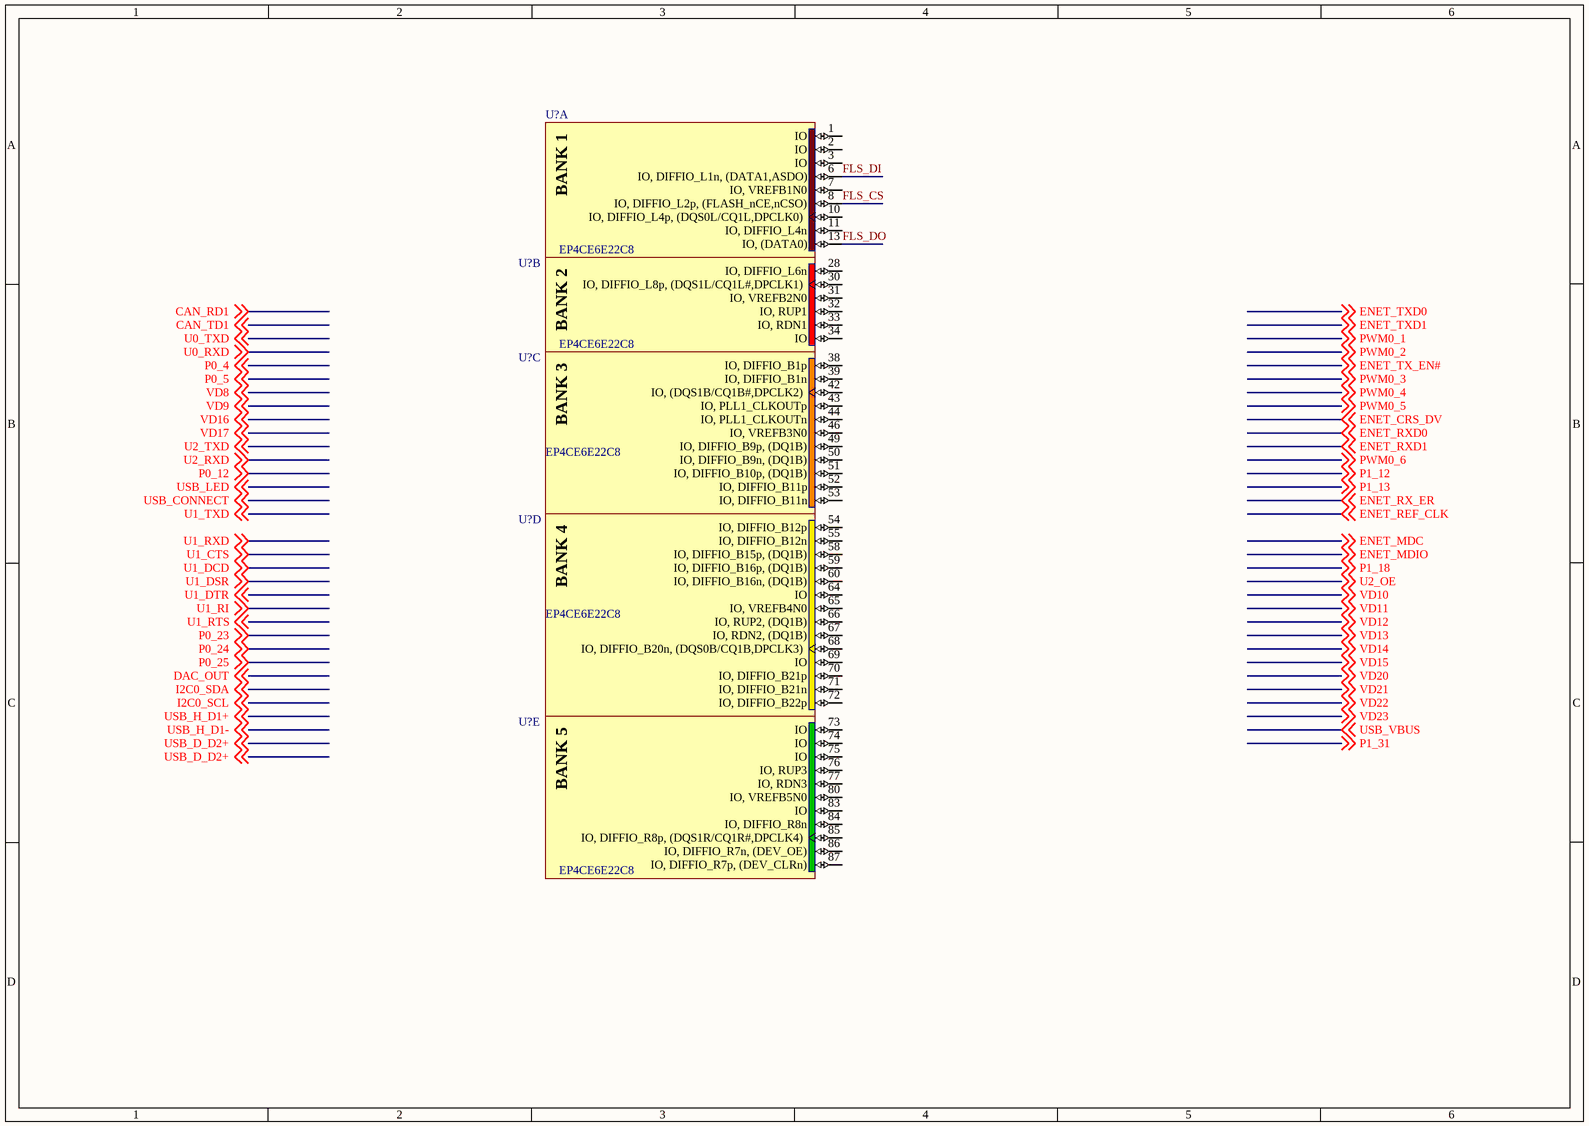
[diagram p6: 01)CPU-1.SchDoc]

### Parts
(Parts that share a designator on the sheet are numbered #1, #2 ... from top to bottom, then left to right.)
U?#9  EP4CE6E22C8  [EQFP144_N]  (part A of 13)
U?#10  EP4CE6E22C8  [EQFP144_N]  (part B of 13)
U?#11  EP4CE6E22C8  [EQFP144_N]  (part C of 13)
U?#12  EP4CE6E22C8  [EQFP144_N]  (part D of 13)
U?#13  EP4CE6E22C8  [EQFP144_N]  (part E of 13)

### Nets
FLS_CS: U?#9.8(IO,_DIFFIO_L2p,_(FLASH_nCE,nCSO))
FLS_DI: U?#9.6(IO,_DIFFIO_L1n,_(DATA1,ASDO))
FLS_DO: U?#9.13(IO,_(DATA0))

Not connected (* = marked no-connect by the designer): U?#9 1(IO) 2(IO) 3(IO) 7(IO,_VREFB1N0) 10(IO,_DIFFIO_L4p,_(DQS0L/CQ1L,DPCLK0)) 11(IO,_DIFFIO_L4n); U?#10 28(IO,_DIFFIO_L6n) 30(IO,_DIFFIO_L8p,_(DQS1L/CQ1L#,DPCLK1)) 31(IO,_VREFB2N0) 32(IO,_RUP1) 33(IO,_RDN1) 34(IO); U?#11 38(IO,_DIFFIO_B1p) 39(IO,_DIFFIO_B1n) 42(IO,_(DQS1B/CQ1B#,DPCLK2)) 43(IO,_PLL1_CLKOUTp) 44(IO,_PLL1_CLKOUTn) 46(IO,_VREFB3N0) 49(IO,_DIFFIO_B9p,_(DQ1B)) 50(IO,_DIFFIO_B9n,_(DQ1B)) 51(IO,_DIFFIO_B10p,_(DQ1B)) 52(IO,_DIFFIO_B11p) 53(IO,_DIFFIO_B11n); U?#12 54(IO,_DIFFIO_B12p) 55(IO,_DIFFIO_B12n) 58(IO,_DIFFIO_B15p,_(DQ1B)) 59(IO,_DIFFIO_B16p,_(DQ1B)) 60(IO,_DIFFIO_B16n,_(DQ1B)) 64(IO) 65(IO,_VREFB4N0) 66(IO,_RUP2,_(DQ1B)) 67(IO,_RDN2,_(DQ1B)) 68(IO,_DIFFIO_B20n,_(DQS0B/CQ1B,DPCLK3)) 69(IO) 70(IO,_DIFFIO_B21p) 71(IO,_DIFFIO_B21n) 72(IO,_DIFFIO_B22p); U?#13 73(IO) 74(IO) 75(IO) 76(IO,_RUP3) 77(IO,_RDN3) 80(IO,_VREFB5N0) 83(IO) 84(IO,_DIFFIO_R8n) 85(IO,_DIFFIO_R8p,_(DQS1R/CQ1R#,DPCLK4)) 86(IO,_DIFFIO_R7n,_(DEV_OE)) 87(IO,_DIFFIO_R7p,_(DEV_CLRn))

### Notes on the sheet
- (in symbol My Title 0) Title:; Size:; Document Number:; Rev:; Draw By:; Date:; Sheet:; of

### Library data of the parts
U?#9-U?#13 = EP4CE6E22C8: as U?#1 on sheet 03)CPU-3; Published: 3-May-2010; DatasheetVersion: ver1.2, Mar-2010; PackageVersion: ver16.0, Dec-2009; PackageReference: EQFP144; Publisher: Altium Limited; PackageDescription: 144-Pin Plastic Enhanced Quad Flat Pack (EQFP144) - Wire Bond; Code_JEDEC: MS-026-BFB; ComponentLink1Description: Manufacturer Link; ComponentLink1URL: http://www.altera.com/; ComponentLink2Description: Handbook; ComponentLink2URL: http://www.altera.com/literature/hb/cyclone-iv/cyclone4-handbook.pdf; ComponentLink3Description: Pinout Specification; ComponentLink3URL: http://www.altera.com/literature/lit-dp.jsp?category=cyc%204&showspreadsheet=y; ComponentLink4Description: Packaging Specification; ComponentLink4URL: http://www.altera.com/literature/ds/dspkg.pdf

## Sheet 08)USB HOST,USB Device,.SchDoc
size 297 x 209 mm
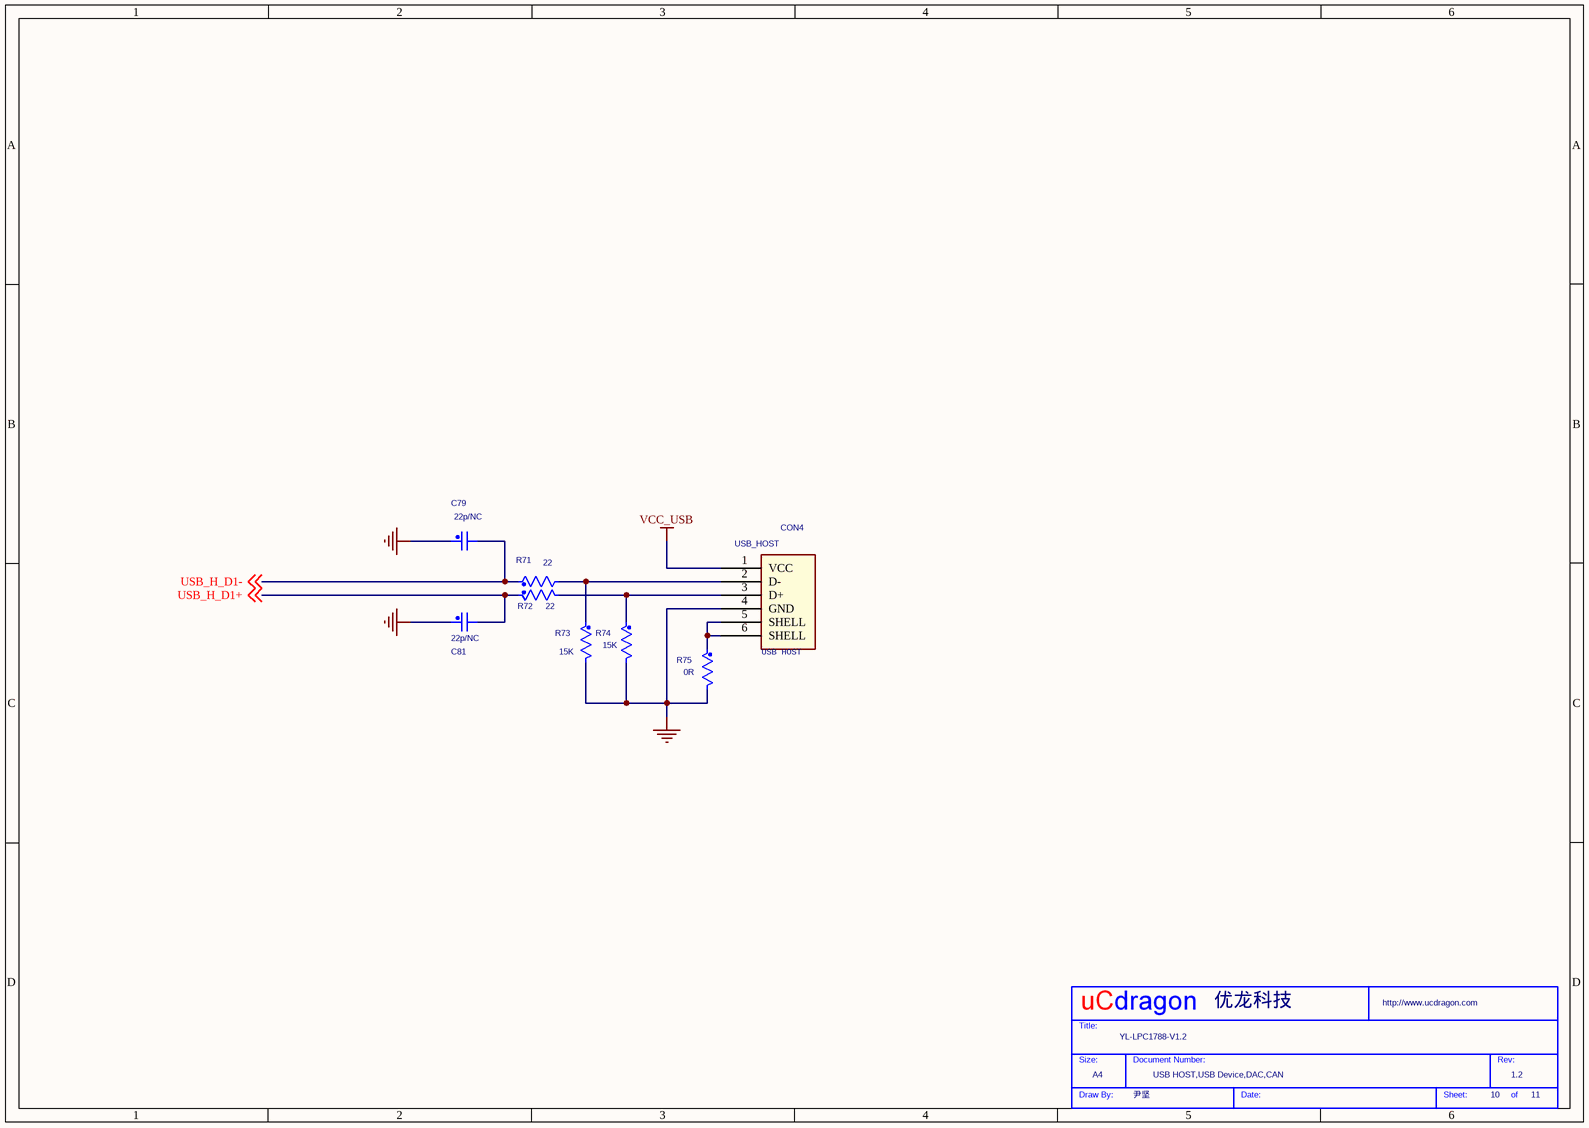
[diagram p7: 08)USB HOST,USB Device,.SchDoc]

### Parts
(Parts that share a designator on the sheet are numbered #1, #2 ... from top to bottom, then left to right.)
*#6  Page Count: 11  Page Number: 10  Page Size: A4  Title: YL-LPC1788-V1.2  RevCode: 1.2  Doc: USB HOST,USB Device,DAC,CAN  Drawing: 尹坚  Company: 优龙科技  (hidden comment: My Title 0)  (graphical)
C79  22p/NC  [CAP0805]
C81  22p/NC  [CAP0805]
CON4  USB_HOST  [USB-B2]
R71  22  [RES0805]
R72  22  [RES0805]
R73  15K  [RES0805]
R74  15K  [RES0805]
R75  0R  [RES0805]

### Nets
GND_POWER: C79.1 C81.1 CON4.4(GND) R73.2 R74.2 R75.2
VCC_USB: CON4.1(VCC)
USB_H_D1+: C81.2 R72.1 ; off-sheet USB_H_D1+
USB_H_D1-: C79.2 R71.1 ; off-sheet USB_H_D1-
NetCON4_2: CON4.2(D-) R71.2 R73.1
NetCON4_3: CON4.3(D+) R72.2 R74.1
NetCON4_5: CON4.5(SHELL) CON4.6(SHELL) R75.1

### Notes on the sheet
- (near CON4) USB HOST
- (in symbol My Title 0) Title:; Size:; Document Number:; Rev:; Draw By:; Date:; Sheet:; of

### Library data of the parts
C79 C81 = C_Generic: Toler.: 10%; P/N #1: C0603C104K4RAC; Voltage: 16V; Mfg #1: KEMET; Dielectric: X7R
CON4 = CON_USB_B
R71 R72 = R_Generic_Dup1: as R22 on sheet 07)Power,JTAG,RESET
R73-R75 = R_Generic_Dup1: as R30#1 on sheet 07)Power,JTAG,RESET; Mfg #3: AVX
*#6 = My Title 0: Page Create Date: May 29, 2006; WebSite: http://www.ucdragon.com

## Sheet 09)KEY,LED.SchDoc
size 297 x 209 mm
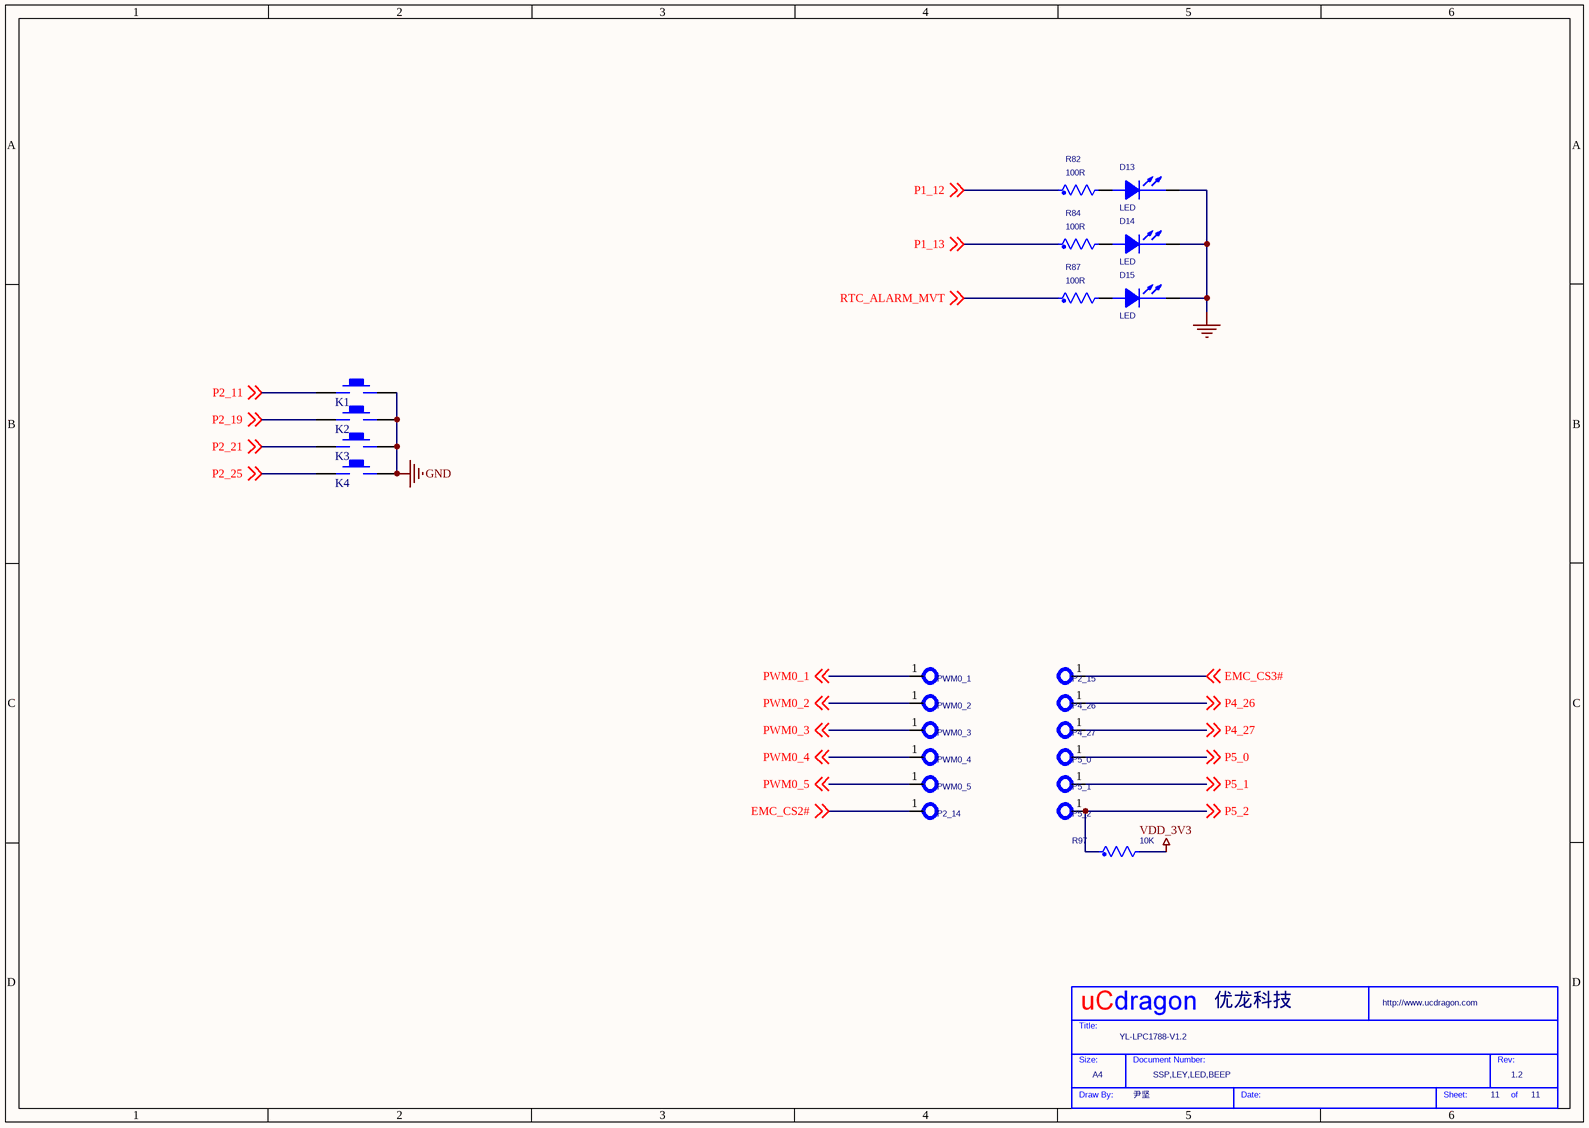
[diagram p8: 09)KEY,LED.SchDoc]

### Parts
(Parts that share a designator on the sheet are numbered #1, #2 ... from top to bottom, then left to right.)
*#7  Page Count: 11  Page Size: A4  Title: YL-LPC1788-V1.2  RevCode: 1.2  Doc: SSP,LEY,LED,BEEP  Drawing: 尹坚  Company: 优龙科技  (hidden comment: My Title 0)  (graphical)
D13  LED
D14  LED
D15  LED
K1#2  KEY_M  [K贴片]  (value not drawn)
K2  KEY_M  [K贴片]  (value not drawn)
K3  KEY_M  [K贴片]  (value not drawn)
K4  KEY_M  [K贴片]  (value not drawn)
R82  100R
R84  100R
R87  100R
R97  10K
TP5  PWM0_1
TP6  P2_15
TP7  PWM0_2
TP8  P4_26
TP9  PWM0_3
TP10  P4_27
TP11  PWM0_4
TP12  P5_0
TP13  PWM0_5
TP14  P5_1
TP15  P2_14
TP16  P5_2

### Nets
GND: K1#2.1 K2.1 K3.1 K4.1
GND_POWER: D13.2(CATHODE) D14.2(CATHODE) D15.2(CATHODE)
VDD_3V3: R97.2
EMC_CS2#: TP15.1 ; off-sheet EMC_CS2#
EMC_CS3#: TP6.1 ; off-sheet EMC_CS3#
P1_12: R82.1 ; off-sheet P1_12
P1_13: R84.1 ; off-sheet P1_13
P2_11: K1#2.2 ; off-sheet P2_11
P2_19: K2.2 ; off-sheet P2_19
P2_21: K3.2 ; off-sheet P2_21
P2_25: K4.2 ; off-sheet P2_25
P4_26: TP8.1 ; off-sheet P4_26
P4_27: TP10.1 ; off-sheet P4_27
P5_0: TP12.1 ; off-sheet P5_0
P5_1: TP14.1 ; off-sheet P5_1
P5_2: R97.1 TP16.1 ; off-sheet P5_2
PWM0_1: TP5.1 ; off-sheet PWM0_1
PWM0_2: TP7.1 ; off-sheet PWM0_2
PWM0_3: TP9.1 ; off-sheet PWM0_3
PWM0_4: TP11.1 ; off-sheet PWM0_4
PWM0_5: TP13.1 ; off-sheet PWM0_5
RTC_ALARM_MVT: R87.1 ; off-sheet RTC_ALARM_MVT
NetD13_1: D13.1(ANODE) R82.2
NetD14_1: D14.1(ANODE) R84.2
NetD15_1: D15.1(ANODE) R87.2

### Notes on the sheet
- (in symbol My Title 0) Title:; Size:; Document Number:; Rev:; Draw By:; Date:; Sheet:; of

### Library data of the parts
R82 R84 R87 R97 = R_Generic_Dup2
TP5-TP16 = TestPoint_1
*#7 = My Title 0: Page Number: 11; Page Create Date: May 29, 2006; WebSite: http://www.ucdragon.com

## Nets that join several sheets
GND: 06)LCD (52 pins), 03)CPU-3 (26 pins), 02)CPU-2 (C9#2.1 C10#2.1 JZ1.2), 09)KEY,LED (K1#2.1 K2.1 K3.1 K4.1)
GND_POWER: 07)Power,JTAG,RESET (29 pins), 05)NorFlash,NandFlash (11 pins), 04)SDRAM (24 pins), 03)CPU-3 (17 pins), 08)USB HOST,USB Device, (6 pins), 09)KEY,LED (D13.2 D14.2 D15.2)
VCC3.3: 06)LCD (15 pins), 03)CPU-3 (C18#2.1 U3#3.3 U3#3.7 U3#3.8)
VDD_3V3: 07)Power,JTAG,RESET (6 pins), 05)NorFlash,NandFlash (17 pins), 04)SDRAM (25 pins), 03)CPU-3 (25 pins), 02)CPU-2 (R4.2), 09)KEY,LED (R97.2)
A0: 05)NorFlash,NandFlash (U4#2.25), 04)SDRAM (U2#2.23 U3#2.23)
A1: 05)NorFlash,NandFlash (U4#2.24), 04)SDRAM (U2#2.24 U3#2.24)
A2: 05)NorFlash,NandFlash (U4#2.23), 04)SDRAM (U2#2.25 U3#2.25)
A3: 05)NorFlash,NandFlash (U4#2.22), 04)SDRAM (U2#2.26 U3#2.26)
A4: 05)NorFlash,NandFlash (U4#2.21), 04)SDRAM (U2#2.29 U3#2.29)
A5: 05)NorFlash,NandFlash (U4#2.20), 04)SDRAM (U2#2.30 U3#2.30)
A6: 05)NorFlash,NandFlash (U4#2.19), 04)SDRAM (U2#2.31 U3#2.31)
A7: 05)NorFlash,NandFlash (U4#2.18), 04)SDRAM (U2#2.32 U3#2.32)
A8: 05)NorFlash,NandFlash (U4#2.8), 04)SDRAM (U2#2.33 U3#2.33)
A9: 05)NorFlash,NandFlash (U4#2.7), 04)SDRAM (U2#2.34 U3#2.34)
A10: 05)NorFlash,NandFlash (U4#2.6), 04)SDRAM (U2#2.22 U3#2.22)
A11: 05)NorFlash,NandFlash (U4#2.5), 04)SDRAM (U2#2.35 U3#2.35)
A12: 05)NorFlash,NandFlash (U4#2.4), 04)SDRAM (U2#2.36 U3#2.36)
A13: 05)NorFlash,NandFlash (U4#2.3), 04)SDRAM (U2#2.20 U3#2.20)
A14: 05)NorFlash,NandFlash (U4#2.2), 04)SDRAM (U2#2.21 U3#2.21)
D0: 05)NorFlash,NandFlash (U4#2.29 U5.29), 04)SDRAM (U2#2.2)
D1: 05)NorFlash,NandFlash (U4#2.31 U5.30), 04)SDRAM (U2#2.4)
D2: 05)NorFlash,NandFlash (U4#2.33 U5.31), 04)SDRAM (U2#2.5)
D3: 05)NorFlash,NandFlash (U4#2.35 U5.32), 04)SDRAM (U2#2.7)
D4: 05)NorFlash,NandFlash (U4#2.38 U5.41), 04)SDRAM (U2#2.8)
D5: 05)NorFlash,NandFlash (U4#2.40 U5.42), 04)SDRAM (U2#2.10)
D6: 05)NorFlash,NandFlash (U4#2.42 U5.43), 04)SDRAM (U2#2.11)
D7: 05)NorFlash,NandFlash (U4#2.44 U5.44), 04)SDRAM (U2#2.13)
D8: 05)NorFlash,NandFlash (U4#2.30), 04)SDRAM (U2#2.42)
D9: 05)NorFlash,NandFlash (U4#2.32), 04)SDRAM (U2#2.44)
D10: 05)NorFlash,NandFlash (U4#2.34), 04)SDRAM (U2#2.45)
D11: 05)NorFlash,NandFlash (U4#2.36), 04)SDRAM (U2#2.47)
D12: 05)NorFlash,NandFlash (U4#2.39), 04)SDRAM (U2#2.48)
D13: 05)NorFlash,NandFlash (U4#2.41), 04)SDRAM (U2#2.50)
D14: 05)NorFlash,NandFlash (R12#1.2 U4#2.43), 04)SDRAM (U2#2.51)
D15: 05)NorFlash,NandFlash (JP1.2 U4#2.45), 04)SDRAM (U2#2.53)
EMC_WE#: 05)NorFlash,NandFlash (U4#2.11 U6.5), 04)SDRAM (U2#2.16 U3#2.16)
FLS_CS: 03)CPU-3 (U3#3.1), 01)CPU-1 (U?#9.8)
FLS_DI: 03)CPU-3 (U3#3.5), 01)CPU-1 (U?#9.6)
FLS_DO: 03)CPU-3 (U3#3.2), 01)CPU-1 (U?#9.13)
TDI: 07)Power,JTAG,RESET (CON1.5 R23#1.2), 03)CPU-3 (P1#2.9 R13#2.2 U?#4.15)